# EasyEDA Pro project eSole.epro

# Schematic Schematic2
Board Name: Board2; Create Date: 2026-06-28; Page Name: P1; Project Name: foot; Schematic Name: Schematic2; Update Date: 2026-06-28; Company: EasyEDA.com; Page Size: A4; Version: V1.0
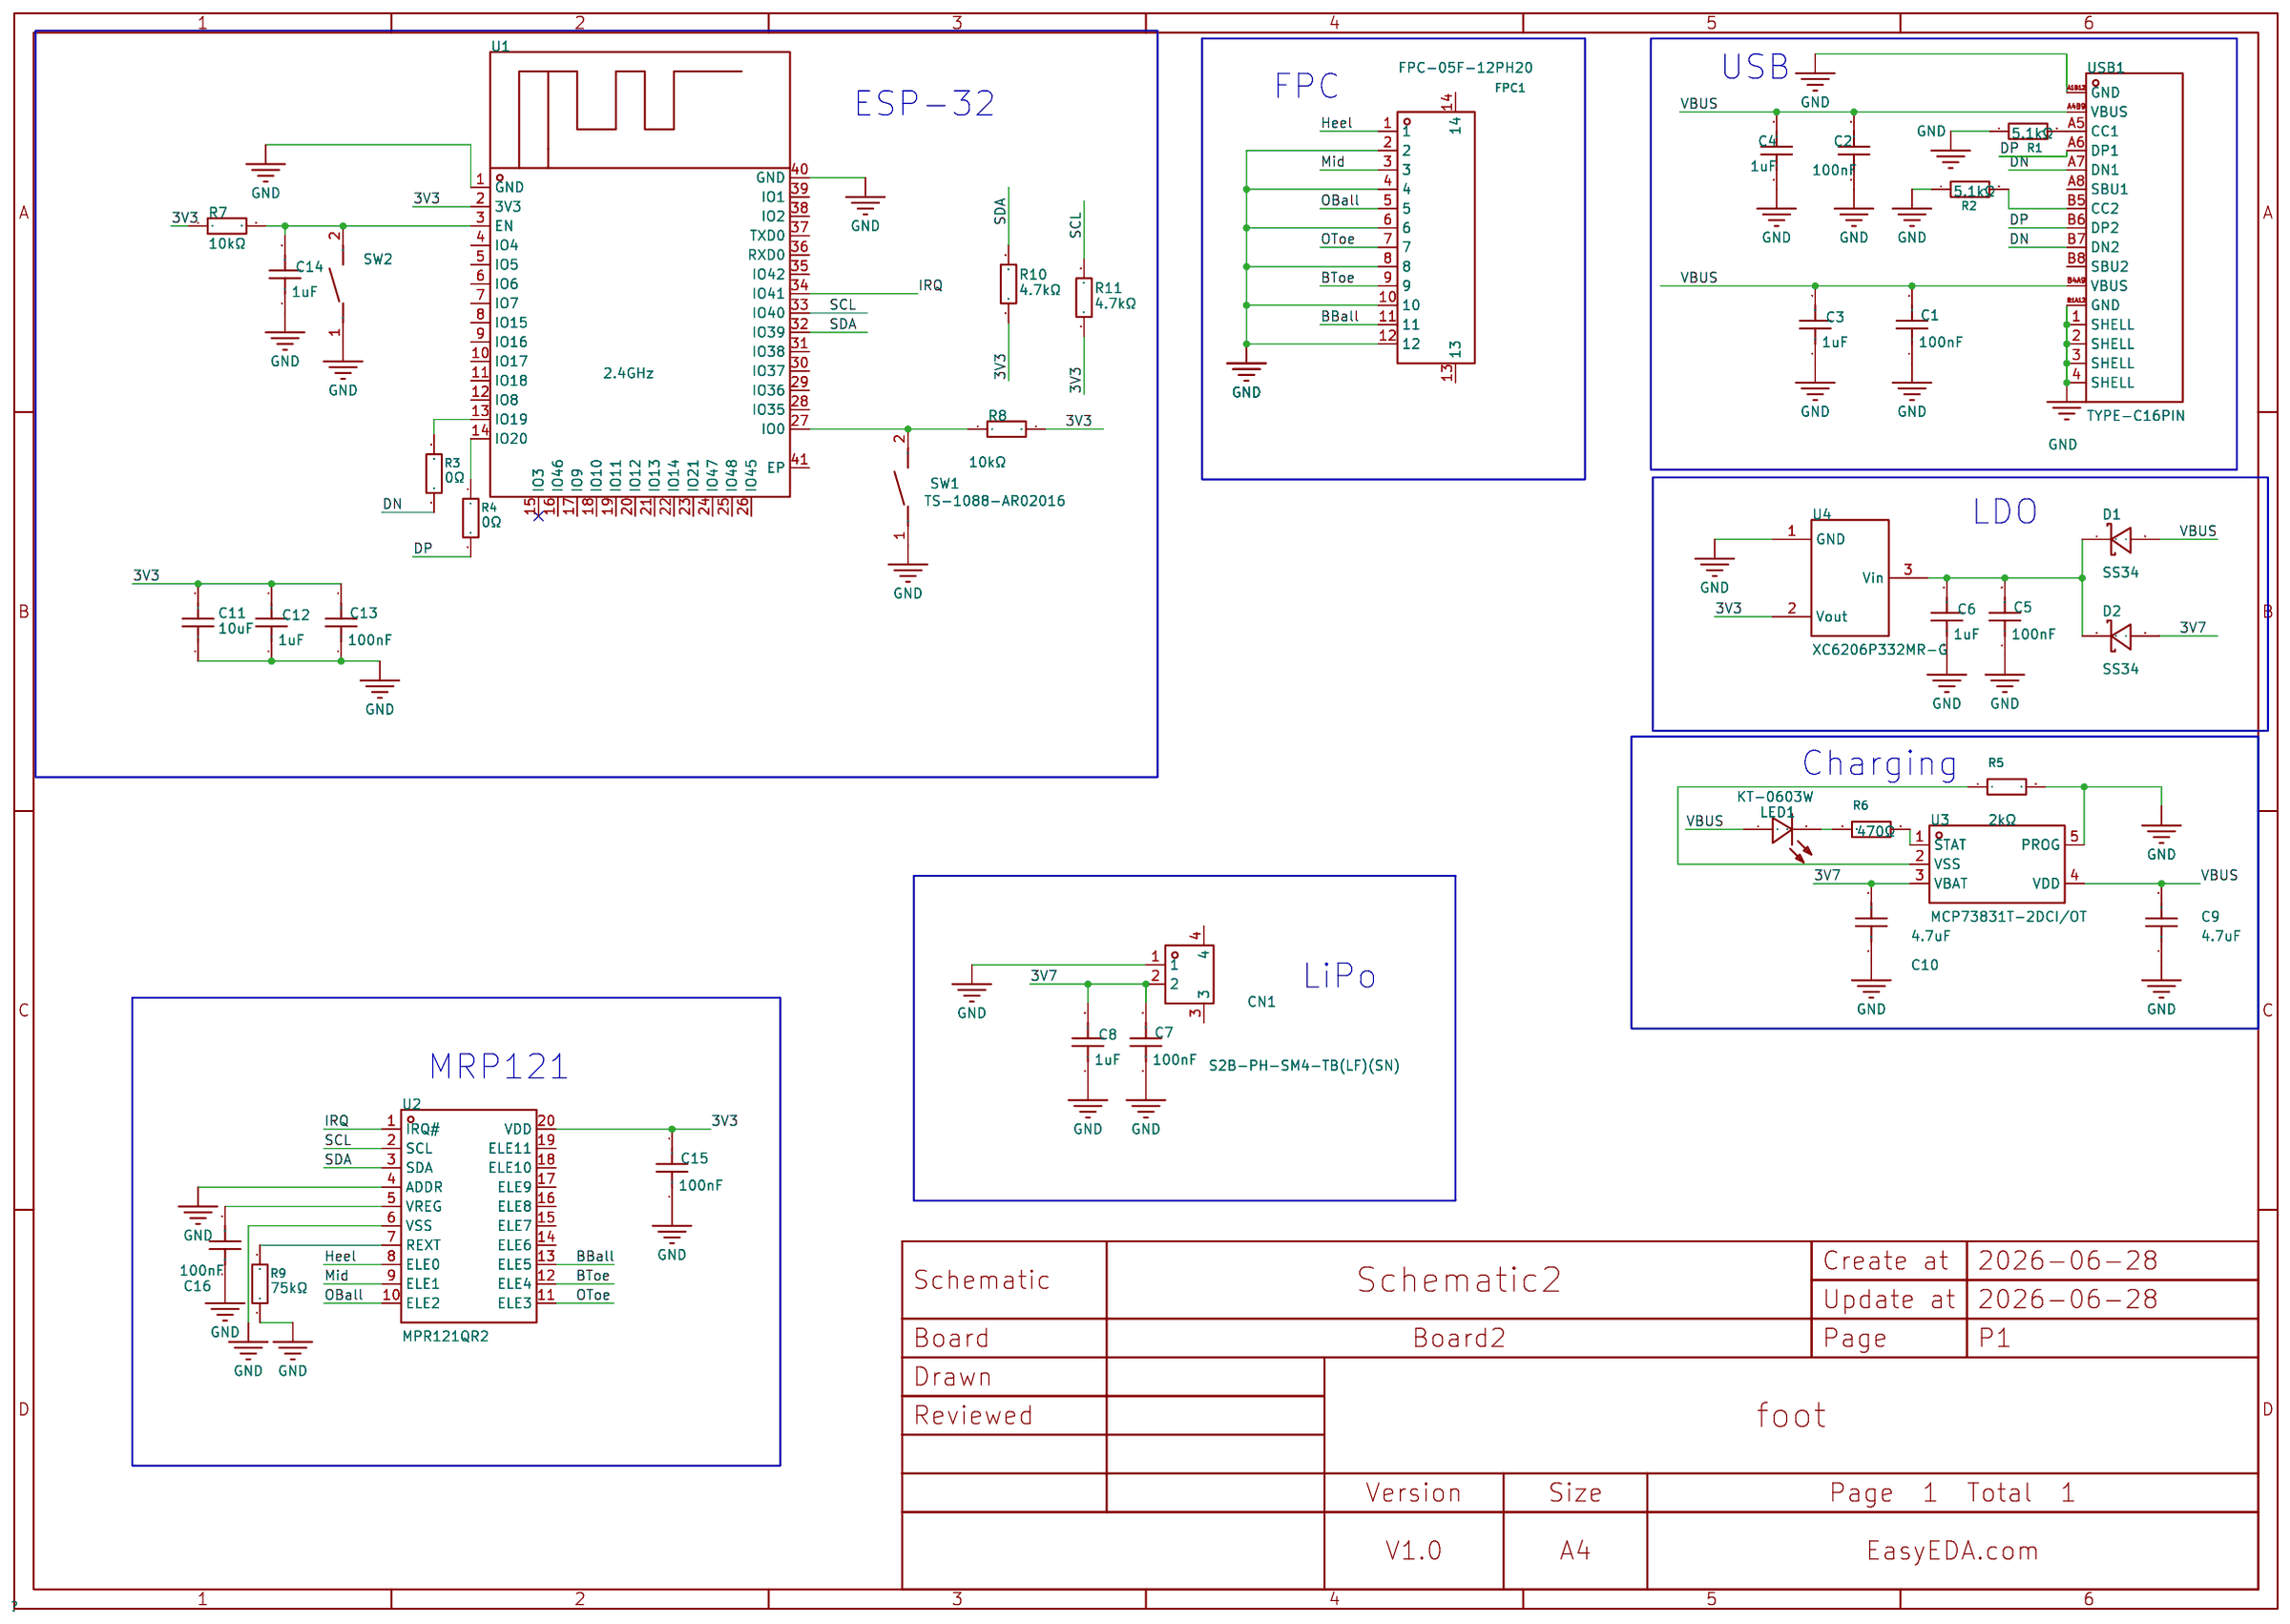
[diagram p0: schematic sheet]

## Parts
C1  100nF  [C0402]
C2  100nF  [C0402]
C3  1uF  [C0402]
C4  1uF  [C0402]
C5  100nF  [C0402]
C6  1uF  [C0402]
C7  100nF  [C0402]
C8  1uF  [C0402]
C9  4.7uF  [C0402]
C10  4.7uF  [C0402]
C11  10uF  [C0603]
C12  1uF  [C0402]
C13  100nF  [C0402]
C14  1uF  [C0402]
C15  100nF  [C0402]
C16  100nF  [C0402]
CN1  S2B-PH-SM4-TB(LF)(SN)  [CONN-SMD_P2.00_S2B-PH-SM4-TB-LF-SN]
D1  SS34  [SMA_L4.3-W2.6-LS5.2-RD]
D2  SS34  [SMA_L4.3-W2.6-LS5.2-RD]
FPC1  FPC-05F-12PH20  [FPC-SMD_12P-P0.50_FPC-05F-12PH20]
LED1  KT-0603W  [LED0603-R-RD_WHITE]
R1  5.1kΩ  [R0402]
R2  5.1kΩ  [R0402]
R3  0Ω  [R0402]
R4  0Ω  [R0402]
R5  2kΩ  [R0402]
R6  470Ω  [R0402]
R7  10kΩ  [R0402]
R8  10kΩ  [R0402]
R9  75kΩ  [R0603]
R10  4.7kΩ  [R0805]
R11  4.7kΩ  [R0805]
SW1  TS-1088-AR02016  [SW-SMD_L3.9-W3.0-P4.45]
SW2  TS-1088-AR02016  [SW-SMD_L3.9-W3.0-P4.45]
U1  2.4GHz  [WIFIM-SMD_ESP32-S3-WROOM-1-N8]
U2  MPR121QR2  [QFN-20_L3.0-W3.0-P0.40-BL]
U3  MCP73831T-2DCI/OT  [SOT-23-5_L2.9-W1.6-P0.95-LS2.8-BL]
U4  XC6206P332MR-G  [SOT-23-3_L2.9-W1.6-P1.90-LS2.8-BR]
USB1  TYPE-C16PIN  [USB-C-SMD_TYPE-C16PIN]

## Library data of the parts
C1 C2 C5 C7 C13 C15 C16 = CL05B104KO5NNNC: Capacitance:100nF Tolerance:±10% Tolerance:±10% Voltage Rating:16V Temperature Coefficient:X7R; LCSC Part Name: 100nF ±10% 16V; Supplier Part: C1525; Manufacturer: SAMSUNG(三星); Supplier Footprint: 0402; JLCPCB Part Class: Basic Part; Datasheet: https://item.szlcsc.com/datasheet/CL05B104KO5NNNC/1877.html; Supplier: LCSC; Tolerance: ±10%; Voltage Rating: 16V; Temperature Coefficient: X7R
C3 C4 C6 C8 C12 C14 = CL05A105KA5NQNC: Capacitance:1uF Tolerance:±10% Tolerance:±10% Voltage Rating:25V Temperature Coefficient:X5R; LCSC Part Name: 1uF ±10% 25V; Supplier Part: C52923; Manufacturer: SAMSUNG(三星); Supplier Footprint: 0402; JLCPCB Part Class: Basic Part; Datasheet: https://item.szlcsc.com/datasheet/CL05A105KA5NQNC/53938.html; Supplier: LCSC; Tolerance: ±10%; Voltage Rating: 25V; Temperature Coefficient: X5R
C9 C10 = CL05A475MP5NRNC: Capacitance:4.7uF Tolerance:±20% Tolerance:±20% Voltage Rating:10V Temperature Coefficient:X5R; LCSC Part Name: 4.7uF ±20% 10V; Supplier Part: C23733; Manufacturer: SAMSUNG(三星); Supplier Footprint: 0402; JLCPCB Part Class: Basic Part; Datasheet: https://item.szlcsc.com/datasheet/CL05A475MP5NRNC/24469.html; Supplier: LCSC; Tolerance: ±20%; Voltage Rating: 10V; Temperature Coefficient: X5R
C11 = CL10A106KP8NNNC: Capacitance:10uF Tolerance:±10% Tolerance:±10% Voltage Rating:10V Temperature Coefficient:X5R; LCSC Part Name: 10uF ±10% 10V; Supplier Part: C19702; Manufacturer: SAMSUNG(三星); Supplier Footprint: 0603; JLCPCB Part Class: Basic Part; Datasheet: https://item.szlcsc.com/datasheet/CL10A106KP8NNNC/20411.html; Supplier: LCSC; Tolerance: ±10%; Voltage Rating: 10V; Temperature Coefficient: X5R
CN1 = S2B-PH-SM4-TB(LF)(SN): Pins Structure:1x2P Pitch:2mm Mounting Style:Horizontal attachment Reference Series:PH Number of Pins:2P Number of Rows:1 Number of PINs Per Row:2 Row Spacing:- Current Rating (Max):2A Contact Material:Copper alloy Contact Plating:Tin Operating Temperatur; LCSC Part Name: 1x2P 间距:2mm 卧贴 系列:PH; Supplier Part: C295747; Manufacturer: JST; Supplier Footprint: SMD,P=2mm,卧贴; JLCPCB Part Class: Extended Part; Datasheet: https://atta.szlcsc.com/upload/public/pdf/source/20210203/C295747_344B2E64535E381E727D98C302AB61C7.pdf; Supplier: LCSC; Pins Structure: 1x2P; Pitch: 2mm; Mounting Style: Horizontal attachment; Reference Series: PH; Number of Pins: 2P; Number of Rows: 1; Number of PINs Per Row: 2; Current Rating (Max): 2A; Contact Material: Copper alloy; Contact Plating: Tin; Operating Temperature Range: -25℃~+85℃; Rated Voltage (Max): 100V; Plastic Material: PA; Flame Retardant Rating: UL94V-0; Supplementary Features: Auxiliary soldering legs; Colour: Beige; Z-Height of the Board: 5.5mm; X-Length of Bottom Edge on Board (Spacing Line): 7.9mm; Y-Width of Bottom Edge on Board: 8.6mm
D1 D2 = SS34_C8678: Diode Configuration:Independent Voltage - Forward(Vf@If):550mV@3A Voltage - DC Reverse(Vr):40V Current - Rectified:3A Reverse Leakage Current (Ir):500uA@40V Operating Junction Temperature Range:-55℃~+125℃ Operating Junction Temperature Range:-55℃~+125℃; LCSC Part Name: 电压:40V 电流:3A; Supplier Part: C8678; Manufacturer: MDD(辰达半导体); Supplier Footprint: SMA(DO-214AC); JLCPCB Part Class: Basic Part; Datasheet: https://item.szlcsc.com/datasheet/SS34/9178.html; Supplier: LCSC; Diode Configuration: Independent; Voltage - Forward(Vf@If): 550mV@3A; Voltage - DC Reverse(Vr): 40V; Current - Rectified: 3A; Reverse Leakage Current (Ir): 500uA@40V; Operating Junction Temperature Range: -55℃~+125℃
FPC1 = FPC-05F-12PH20: Locking Feature:Hinged Lid Contact Type:Surface Mount Number of Contacts:12P Pitch:0.5mm Mounting Type:Bottom Contact FFC, FCB Thickness:0.3mm FFC, FCB Thickness:0.3mm Height Above Board:2mm Contact Material:Phosphor Bronze Contact Plating:Tin Operating T; LCSC Part Name: 翻盖式 卧贴 P数:12P 间距:0.5mm; Supplier Part: C2856799; Manufacturer: XUNPU(讯普); Supplier Footprint: SMD,P=0.5mm,卧贴; JLCPCB Part Class: Extended Part; Datasheet: https://item.szlcsc.com/datasheet/FPC-05F-12PH20/3056897.html; Supplier: LCSC; Locking Feature: Hinged Lid; Contact Type: Surface Mount; Number of Contacts: 12P; Pitch: 0.5mm; Mounting Type: Bottom Contact; FFC, FCB Thickness: 0.3mm; Height Above Board: 2mm; Contact Material: Phosphor Bronze; Contact Plating: Tin; Operating Temperature: -25℃~+85℃; Rated Voltage (Max): 50V; Current Rating (Max): 500mA
LED1 = KT-0603W: Lamp Holder Type:1.6mm x 0.8mm square LED Illumination Color:White Voltage - Forward(Vf):2.6V~3.1V Voltage - Forward(Vf):2.6V~3.1V Power(Watts):100mW Forward Current:5mA Wavelength - Dominant:- Wavelength - Dominant:- Peak Wavelength:- Peak Wavelength:- D; LCSC Part Name: 0603 白灯 高亮; Supplier Part: C2290; Manufacturer: KENTO; Supplier Footprint: 0603; JLCPCB Part Class: Basic Part; Datasheet: https://item.szlcsc.com/datasheet/KT-0603W/2663.html; Supplier: LCSC; Lamp Holder Type: 1.6mm x 0.8mm square LED; Illumination Color: White; Voltage - Forward(Vf): 2.6V~3.1V; Power(Watts): 100mW; Forward Current: 5mA; Diode Configuration: Discrete Diode; Lens Color: Yellow Lens; Color Temperature: 40000K~100000K; Luminous Intensity: 360mcd; Viewing Angle: 120°; Mounting Style: Top-mount; Operating Temperature: -40℃~+85℃
R1 R2 = 0402WGF5101TCE: Type:Thick Film Resistor Resistance:5.1kΩ Tolerance:±1% Tolerance:±1% Power(Watts):62.5mW Voltage-Supply(Max):50V Temperature Coefficient:±100ppm/℃ Temperature Coefficient:±100ppm/℃ Operating Temperature:-55℃~+155℃ Operating Temperature:-55℃~+155℃; LCSC Part Name: 5.1kΩ ±1% 62.5mW 厚膜电阻; Supplier Part: C25905; Manufacturer: UNI-ROYAL(厚声); Supplier Footprint: 0402; JLCPCB Part Class: Basic Part; Datasheet: https://item.szlcsc.com/datasheet/0402WGF5101TCE/26648.html; Supplier: LCSC; Type: Thick Film Resistor; Tolerance: ±1%; Power(Watts): 62.5mW; Voltage-Supply(Max): 50V; Temperature Coefficient: ±100ppm/℃; Operating Temperature: -55℃~+155℃
R3 R4 = 0402WGF0000TCE: Type:Thick Film Resistor Resistance:0Ω Tolerance:±1% Tolerance:±1% Power(Watts):62.5mW Voltage-Supply(Max):50V Temperature Coefficient:±800ppm/℃ Temperature Coefficient:±800ppm/℃ Operating Temperature:-55℃~+155℃ Operating Temperature:-55℃~+155℃; LCSC Part Name: 0Ω ±1% 62.5mW 厚膜电阻; Supplier Part: C17168; Manufacturer: UNI-ROYAL(厚声); Supplier Footprint: 0402; JLCPCB Part Class: Basic Part; Datasheet: https://item.szlcsc.com/datasheet/0402WGF0000TCE/17853.html; Supplier: LCSC; Type: Thick Film Resistor; Tolerance: ±1%; Power(Watts): 62.5mW; Voltage-Supply(Max): 50V; Temperature Coefficient: ±800ppm/℃; Operating Temperature: -55℃~+155℃
R5 = 0402WGF2001TCE: Type:Thick Film Resistors Resistance:2kΩ Tolerance:±1% Tolerance:±1% Power(Watts): Overload Voltage (Max): Temperature Coefficient:±100ppm/℃ Temperature Coefficient:±100ppm/℃ Operating Temperature Range:-55℃~+155℃ Operating Temperature Range:-55℃~+155℃; LCSC Part Name: 2kΩ ±1% 62.5mW 厚膜电阻; Supplier Part: C4109; Manufacturer: UNI-ROYAL(厚声); Supplier Footprint: 0402; JLCPCB Part Class: Basic Part; Datasheet: https://atta.szlcsc.com/upload/public/pdf/source/20200306/C422600_1E6D84923E4A46A82E41ADD87F860B5C.pdf; Supplier: LCSC; Type: Thick Film Resistors; Tolerance: ±1%; Temperature Coefficient: ±100ppm/℃; Operating Temperature Range: -55℃~+155℃
R6 = 0402WGF4700TCE: Type:Thick Film Resistor Resistance:470Ω Tolerance:±1% Tolerance:±1% Power(Watts):62.5mW Voltage-Supply(Max):50V Temperature Coefficient:±100ppm/℃ Temperature Coefficient:±100ppm/℃ Operating Temperature:-55℃~+155℃ Operating Temperature:-55℃~+155℃; LCSC Part Name: 470Ω ±1% 62.5mW 厚膜电阻; Supplier Part: C25117; Manufacturer: UNI-ROYAL(厚声); Supplier Footprint: 0402; JLCPCB Part Class: Basic Part; Datasheet: https://item.szlcsc.com/datasheet/0402WGF4700TCE/25860.html; Supplier: LCSC; Type: Thick Film Resistor; Tolerance: ±1%; Power(Watts): 62.5mW; Voltage-Supply(Max): 50V; Temperature Coefficient: ±100ppm/℃; Operating Temperature: -55℃~+155℃
R7 R8 = 0402WGF1002TCE: Type:Thick Film Resistor Resistance:10kΩ Tolerance:±1% Tolerance:±1% Power(Watts):62.5mW Voltage-Supply(Max):50V Temperature Coefficient:±100ppm/℃ Temperature Coefficient:±100ppm/℃ Operating Temperature:-55℃~+155℃ Operating Temperature:-55℃~+155℃; LCSC Part Name: 10kΩ ±1% 62.5mW 厚膜电阻; Supplier Part: C25744; Manufacturer: UNI-ROYAL(厚声); Supplier Footprint: 0402; JLCPCB Part Class: Basic Part; Datasheet: https://item.szlcsc.com/datasheet/0402WGF1002TCE/26487.html; Supplier: LCSC; Type: Thick Film Resistor; Tolerance: ±1%; Power(Watts): 62.5mW; Voltage-Supply(Max): 50V; Temperature Coefficient: ±100ppm/℃; Operating Temperature: -55℃~+155℃
R9 = 0603WAF7502T5E: Type:Thick Film Resistor Resistance:75kΩ Tolerance:±1% Tolerance:±1% Power(Watts):100mW Voltage-Supply(Max):75V Temperature Coefficient:±100ppm/℃ Temperature Coefficient:±100ppm/℃ Operating Temperature:-55℃~+155℃ Operating Temperature:-55℃~+155℃; LCSC Part Name: 75kΩ ±1% 100mW 厚膜电阻; Supplier Part: C23242; Manufacturer: UNI-ROYAL(厚声); Supplier Footprint: 0603; JLCPCB Part Class: Basic Part; Datasheet: https://item.szlcsc.com/datasheet/0603WAF7502T5E/23969.html; Supplier: LCSC; Type: Thick Film Resistor; Tolerance: ±1%; Power(Watts): 100mW; Voltage-Supply(Max): 75V; Temperature Coefficient: ±100ppm/℃; Operating Temperature: -55℃~+155℃
R10 R11 = 0805W8F4701T5E: Type:Thick Film Resistors Resistance:4.7kΩ Tolerance:±1% Tolerance:±1% Power(Watts): Overload Voltage (Max): Temperature Coefficient:±100ppm/℃ Temperature Coefficient:±100ppm/℃ Operating Temperature Range:-55℃~+155℃ Operating Temperature Range:-55℃~+155℃; LCSC Part Name: 4.7kΩ ±1% 125mW 厚膜电阻; Supplier Part: C17673; Manufacturer: UNI-ROYAL(厚声); Supplier Footprint: 0805; JLCPCB Part Class: Basic Part; Datasheet: https://atta.szlcsc.com/upload/public/pdf/source/20200306/C422600_1E6D84923E4A46A82E41ADD87F860B5C.pdf; Supplier: LCSC; Type: Thick Film Resistors; Tolerance: ±1%; Temperature Coefficient: ±100ppm/℃; Operating Temperature Range: -55℃~+155℃
SW1 SW2 = TS-1088-AR02016: Circuit:SPST Actuator Style:Round Button Operating Force:1.6N Mounting Type:Surface Mount,Vertical Length:3.9mm Width:3mm Switch Height:2mm with Bracket:Without Bracket Contact Current:50mA Voltage Rating:12V Actuator/Cap Color:Black With Lamp:- IP Rating; LCSC Part Name: 3.9*3*2mm 立贴 轻触开关; Supplier Part: C720477; Manufacturer: XUNPU(讯普); Supplier Footprint: SMD,4x3mm; JLCPCB Part Class: Basic Part; Datasheet: https://item.szlcsc.com/datasheet/TS-1088-AR02016/763484.html; Supplier: LCSC; Circuit: SPST; Actuator Style: Round Button; Operating Force: 1.6N; Mounting Type: Surface Mount,Vertical; Length: 3.9mm; Width: 3mm; Switch Height: 2mm; with Bracket: Without Bracket; Contact Current: 50mA; Voltage Rating: 12V; Actuator/Cap Color: Black; Termination Style: SMD(SMT) Tab; Life: 100,000 cycles; Operating Temperature: -30℃~+80℃
U1 = ESP32-S3-WROOM-1-N8: Utilized IC / Part:ESP32-S3 Chip Wireless Standard:Bluetooth5.0 Interface Type:SPI；I2S；USB；I2C；UART Frequency:2.4GHz Antenna Type:On-board PCB Antenna Output Power:20.5dBm Output Power:20.5dBm Voltage - Supply:3V~3.6V Voltage - Supply:3V~3.6V Receive  Cur; LCSC Part Name: 不带固件 通用型Wi-Fi+低功耗蓝牙MCU模组; Supplier Part: C2913198; Manufacturer: ESPRESSIF(乐鑫); Supplier Footprint: SMD,25.5x18mm; JLCPCB Part Class: Extended Part; Datasheet: https://item.szlcsc.com/datasheet/ESP32-S3-WROOM-1-N8/3198296.html; Supplier: LCSC; Utilized IC / Part: ESP32-S3 Chip; Wireless Standard: Bluetooth5.0; Interface Type: SPI；I2S；USB；I2C；UART; Antenna Type: On-board PCB Antenna; Output Power: 20.5dBm; Voltage - Supply: 3V~3.6V; Receive  Current: 95mA; Send  Current: 355mA; Sensitivity: -98.2dBm; Operating Temperature: -40℃~+85℃
U2 = MPR121QR2: Number of Channels:12 Chip Function:Capacitive Touch Voltage - Supply:1.71V~3.6V Voltage - Supply:1.71V~3.6V Current - Supply:29uA Operating Temperature:-40℃~+85℃ Operating Temperature:-40℃~+85℃ Standby Current:3uA ESD Protection Voltage:2kV; Supplier Part: C91322; Manufacturer: NXP(恩智浦); Supplier Footprint: QFN-20(3x3); JLCPCB Part Class: Extended Part; Datasheet: https://item.szlcsc.com/datasheet/MPR121QR2/92511.html; Supplier: LCSC; Number of Channels: 12; Chip Function: Capacitive Touch; Voltage - Supply: 1.71V~3.6V; Current - Supply: 29uA; Operating Temperature: -40℃~+85℃; Standby Current: 3uA; ESD Protection Voltage: 2kV
U3 = MCP73831T-2DCI/OT: The Chip Type:Charging IC Voltage - Supply:3.75V~6V Voltage - Supply:3.75V~6V Charge Current - Max:550mA Charging Saturation Voltage:4.2V End-Off Voltage:- Type of Battery:Lithium Battery Number of Cells:1 Number of Cells:1 Operating Temperature:-40℃~+85℃; LCSC Part Name: 单节全集成锂离子/锂聚合物充电管理控制器; Supplier Part: C625597; Manufacturer: MICROCHIP(美国微芯); Supplier Footprint: SOT-23-5; JLCPCB Part Class: Extended Part; Datasheet: https://item.szlcsc.com/datasheet/MCP73831T-2DCI%252FOT/655504.html; Supplier: LCSC; The Chip Type: Charging IC; Voltage - Supply: 3.75V~6V; Charge Current - Max: 550mA; Charging Saturation Voltage: 4.2V; Type of Battery: Lithium Battery; Number of Cells: 1; Operating Temperature: -40℃~+85℃; Battery Temperature Detection: Not supported; Supply Current (Iq): 53uA
U4 = XC6206P332MR-G_C5446: Output Configuration:Positive Voltage - Supply:6V Output Voltage:3.3V Output Voltage:3.3V Output Current:200mA Power Supply Rejection Ratio (PSRR):- Voltage Dropout:- standby current:1uA Noise:- Features:Short Circuit Protection；Over Current Protection Op; LCSC Part Name: 3.3V 200mA 6V; Supplier Part: C5446; Manufacturer: TOREX(特瑞仕); Supplier Footprint: SOT-23-3L; JLCPCB Part Class: Basic Part; Datasheet: https://item.szlcsc.com/datasheet/XC6206P332MR-G/5896.html; Supplier: LCSC; Output Configuration: Positive; Voltage - Supply: 6V; Output Voltage: 3.3V; Output Current: 200mA; standby current: 1uA; Features: Short Circuit Protection；Over Current Protection; Operating Temperature: -40℃~+85℃@(Ta); Output Type: Fixed; Number of Outputs: 1
USB1 = TYPE-C16PIN: Connector Type:Type-C Protocol Standard:- Gender:Female Mounting Type:Surface Mount, Right Angle Number of Contacts:16P Number of Ports:1 Current Rating-Power:3A Voltage Rating:30V Connect-Disconnect Life:10,000 Cycles Supplementary Features:- Center Heig; LCSC Part Name: 16P卧贴母座; Supplier Part: C393939; Manufacturer: SHOU HAN(首韩); Supplier Footprint: SMD; JLCPCB Part Class: Extended Part; Datasheet: https://item.szlcsc.com/datasheet/TYPE-C16PIN/372551.html; Supplier: LCSC; Connector Type: Type-C; Gender: Female; Mounting Type: Surface Mount, Right Angle; Number of Contacts: 16P; Number of Ports: 1; Current Rating-Power: 3A; Voltage Rating: 30V; Connect-Disconnect Life: 10,000 Cycles; Detection color: Black; Operating Temperature: -40℃~+85℃

## Nets
3V3: C11.2 C12.2 C13.2 C15.2 R7.1 R8.2 R10.1 R11.1 U1.2(3V3) U2.20(VDD) U4.2(Vout)
3V7: C7.2 C8.2 C10.2 CN1.2 D2.2(A) U3.3(VBAT)
GND: C1.1 C2.1 C3.1 C4.1 C5.1 C6.1 C7.1 C8.1 C9.1 C10.1 C11.1 C12.1 C13.1 C14.1 C15.1 C16.1 CN1.1 FPC1.2 FPC1.4 FPC1.6 FPC1.8 FPC1.10 FPC1.12 R1.1 R2.1 R5.2 R9.1 SW1.1 SW2.1 U1.1(GND) U1.40(GND) U2.4(ADDR) U2.6(VSS) U3.5(PROG) U4.1(GND) USB1.1(SHELL) USB1.2(SHELL) USB1.3(SHELL) USB1.4(SHELL) USB1.A1B12(GND) USB1.B1A12(GND)
VBUS: C1.2 C2.2 C3.2 C4.2 C9.2 D1.2(A) LED1.1(A) U3.4(VDD) USB1.A4B9(VBUS) USB1.B4A9(VBUS)
BBall: FPC1.11 U2.13(ELE5)
BToe: FPC1.9 U2.12(ELE4)
DN: R3.1 USB1.A7(DN1) USB1.B7(DN2)
DP: R4.2 USB1.A6(DP1) USB1.B6(DP2)
Heel: FPC1.1 U2.8(ELE0)
IRQ: U1.34(IO41) U2.1(IRQ#)
Mid: FPC1.3 U2.9(ELE1)
OBall: FPC1.5 U2.10(ELE2)
OToe: FPC1.7 U2.11(ELE3)
SCL: R11.2 U1.33(IO40) U2.2(SCL)
SDA: R10.2 U1.32(IO39) U2.3(SDA)
$1N6: R1.2 USB1.A5(CC1)
$1N8: R2.2 USB1.B5(CC2)
$1N10: C5.2 C6.2 D1.1(K) D2.1(K) U4.3(Vin)
$1N17: R3.2 U1.13(IO19)
$1N49: R5.1 U3.2(VSS)
$1N54: R6.2 U3.1(STAT)
$1N55: LED1.2(K) R6.1
$1N65: C14.2 R7.2 SW2.2 U1.3(EN)
$1N68: R8.1 SW1.2 U1.27(IO0)
$1N84: C16.2 U2.5(VREG)
$1N85: R9.2 U2.7(REXT)
$1N93: R4.1 U1.14(IO20)

Not connected (* = marked no-connect by the designer): CN1 3 4; FPC1 13 14; U1 4(IO4) 5(IO5) 6(IO6) 7(IO7) 8(IO15) 9(IO16) 10(IO17) 11(IO18) 12(IO8) 15(IO3)* 16(IO46) 17(IO9) 18(IO10) 19(IO11) 20(IO12) 21(IO13) 22(IO14) 23(IO21) 24(IO47) 25(IO48) 26(IO45) 28(IO35) 29(IO36) 30(IO37) 31(IO38) 35(IO42) 36(RXD0) 37(TXD0) 38(IO2) 39(IO1) 41(EP); U2 14(ELE6) 15(ELE7) 16(ELE8) 17(ELE9) 18(ELE10) 19(ELE11); USB1 A8(SBU1) B8(SBU2)

## Notes on the sheet
- USB
- FPC
- ESP-32
- LDO
- Charging
- LiPo
- MRP121

# Schematic Schematic1
Board Name: Board1; Create Date: 2026-06-20; Page Name: P1; Project Name: foot; Schematic Name: Schematic1; Update Date: 2026-06-20; Company: EasyEDA.com; Page Size: A4; Version: V1.0
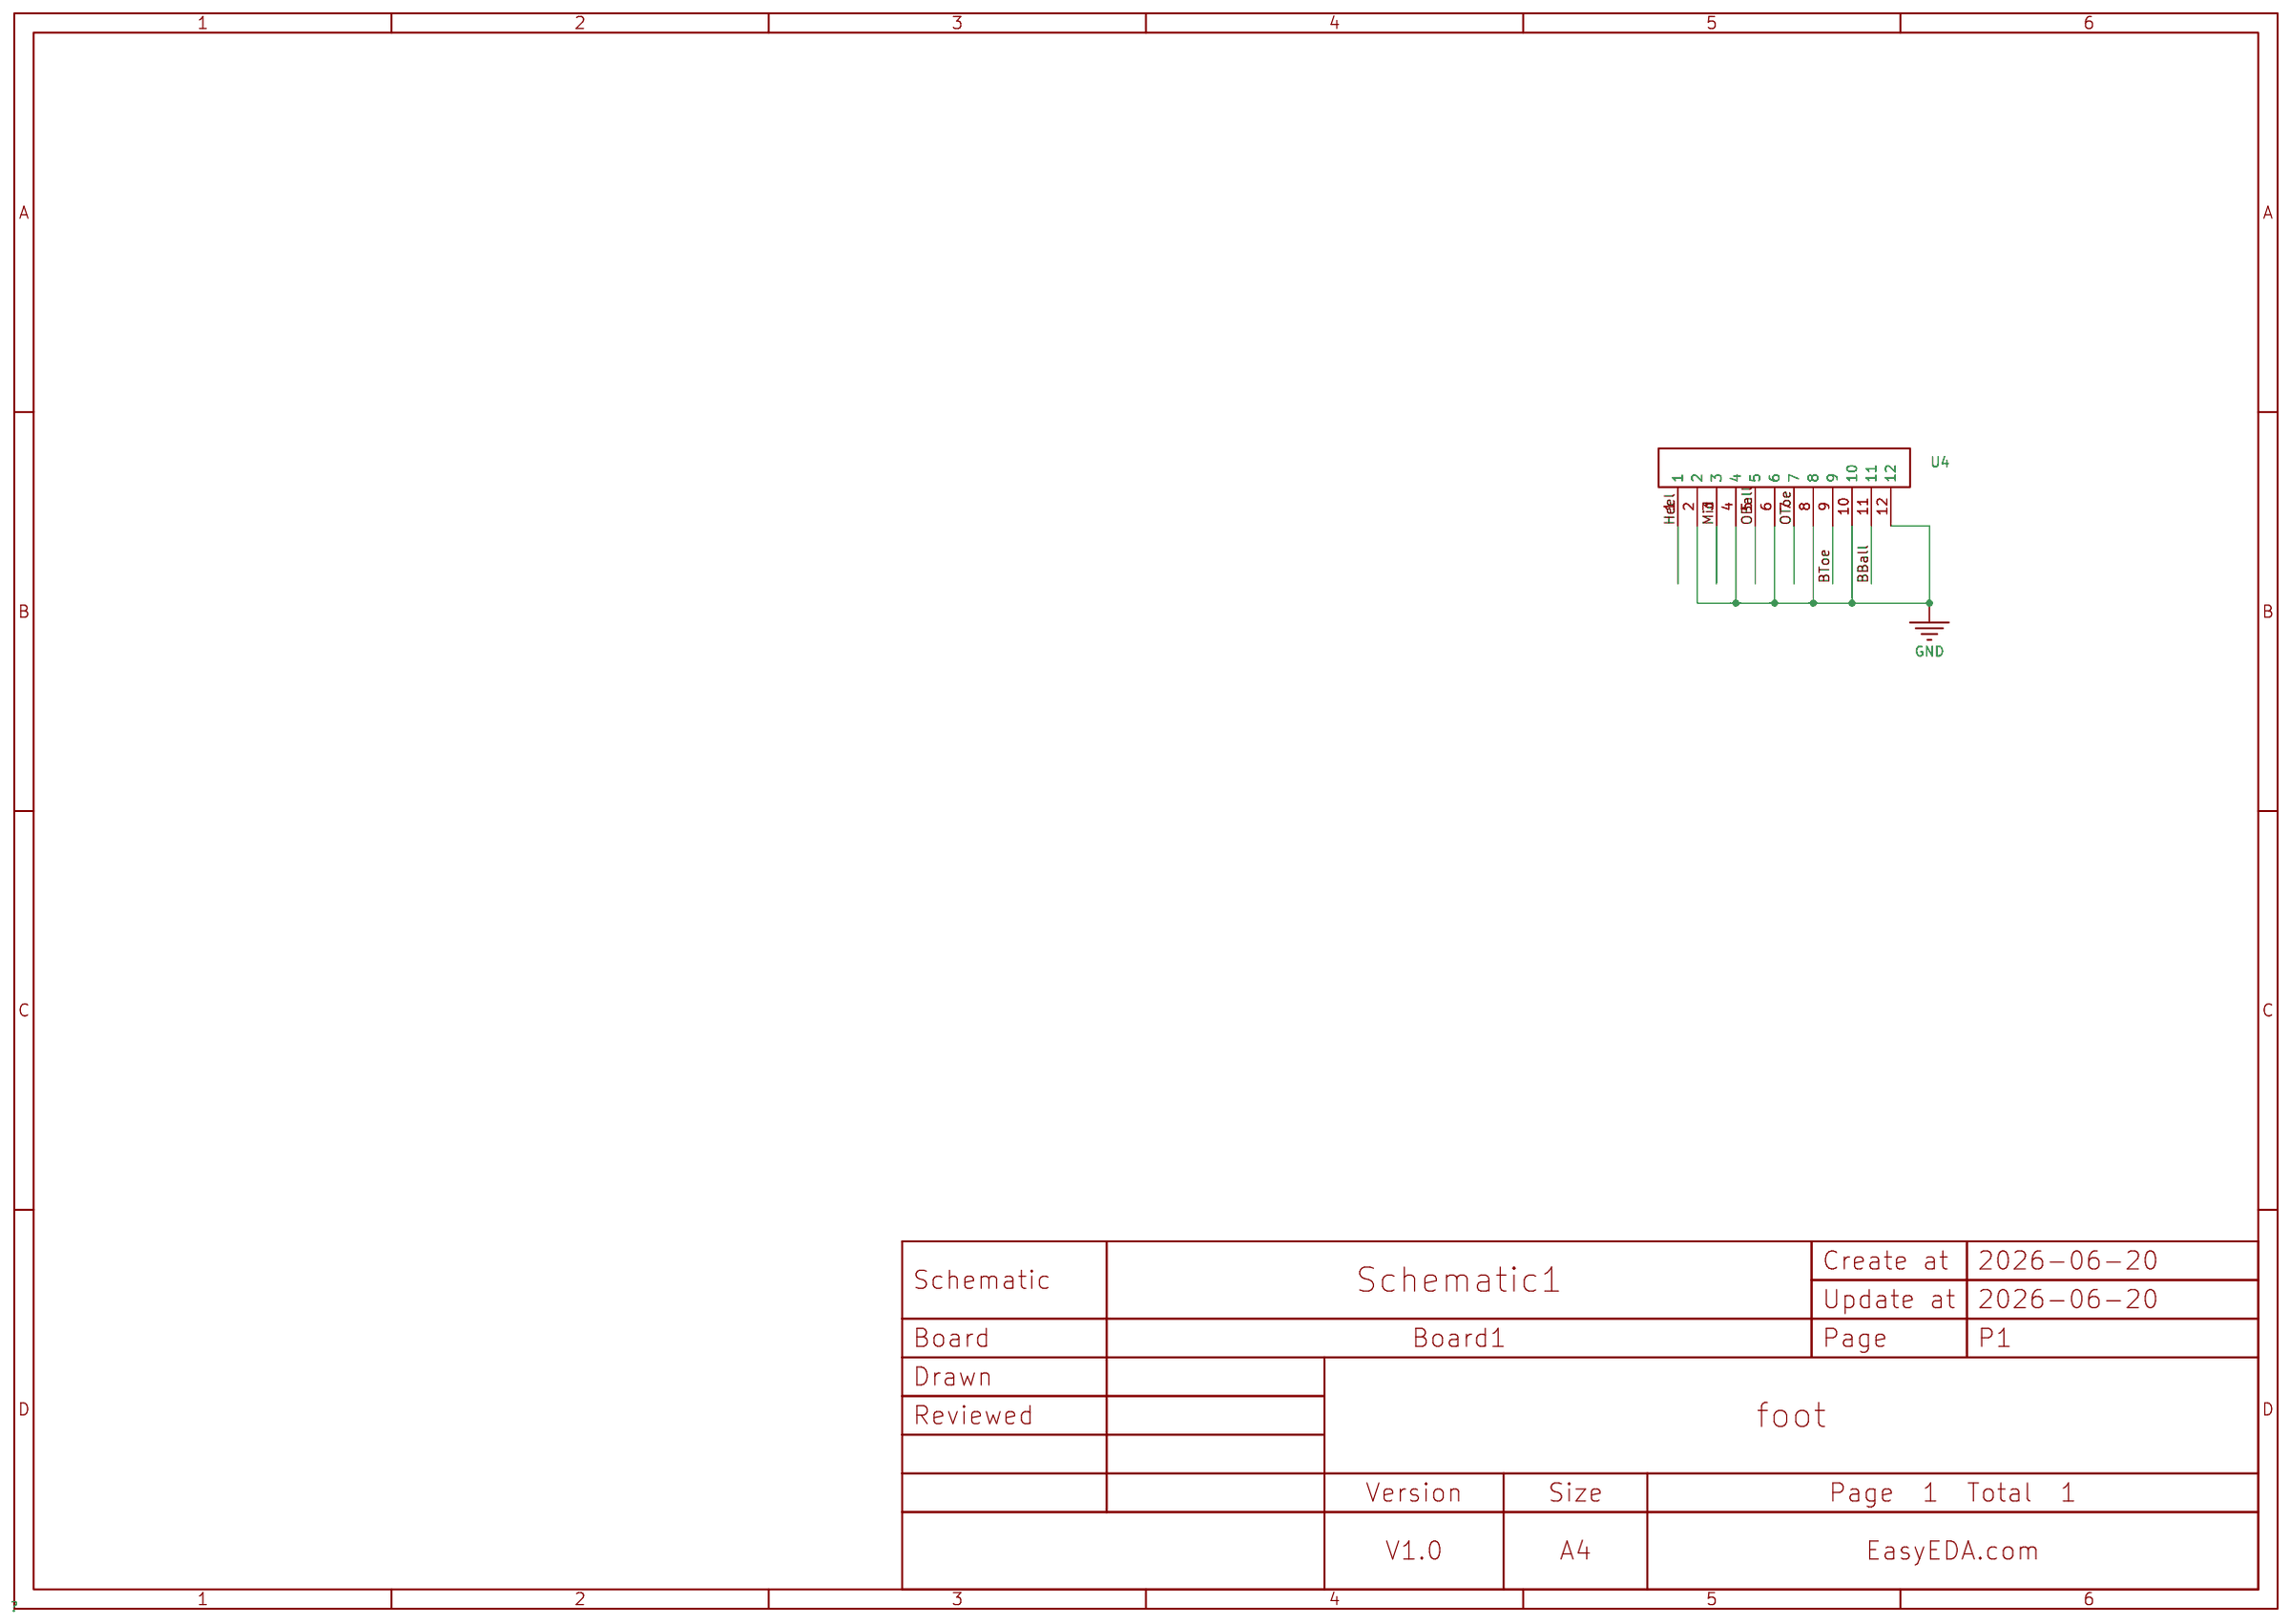
[diagram p1: schematic sheet]

## Parts
U4  -  [FlatCable-12pin]

## Library data of the parts
U4 = FPC-12PIN

## Nets
GND: U4.2 U4.4 U4.6 U4.8 U4.10 U4.12
BBall: U4.11
BToe: U4.9
Heel: U4.1
Mid: U4.3
OBall: U4.5
OToe: U4.7

# Board PCB1
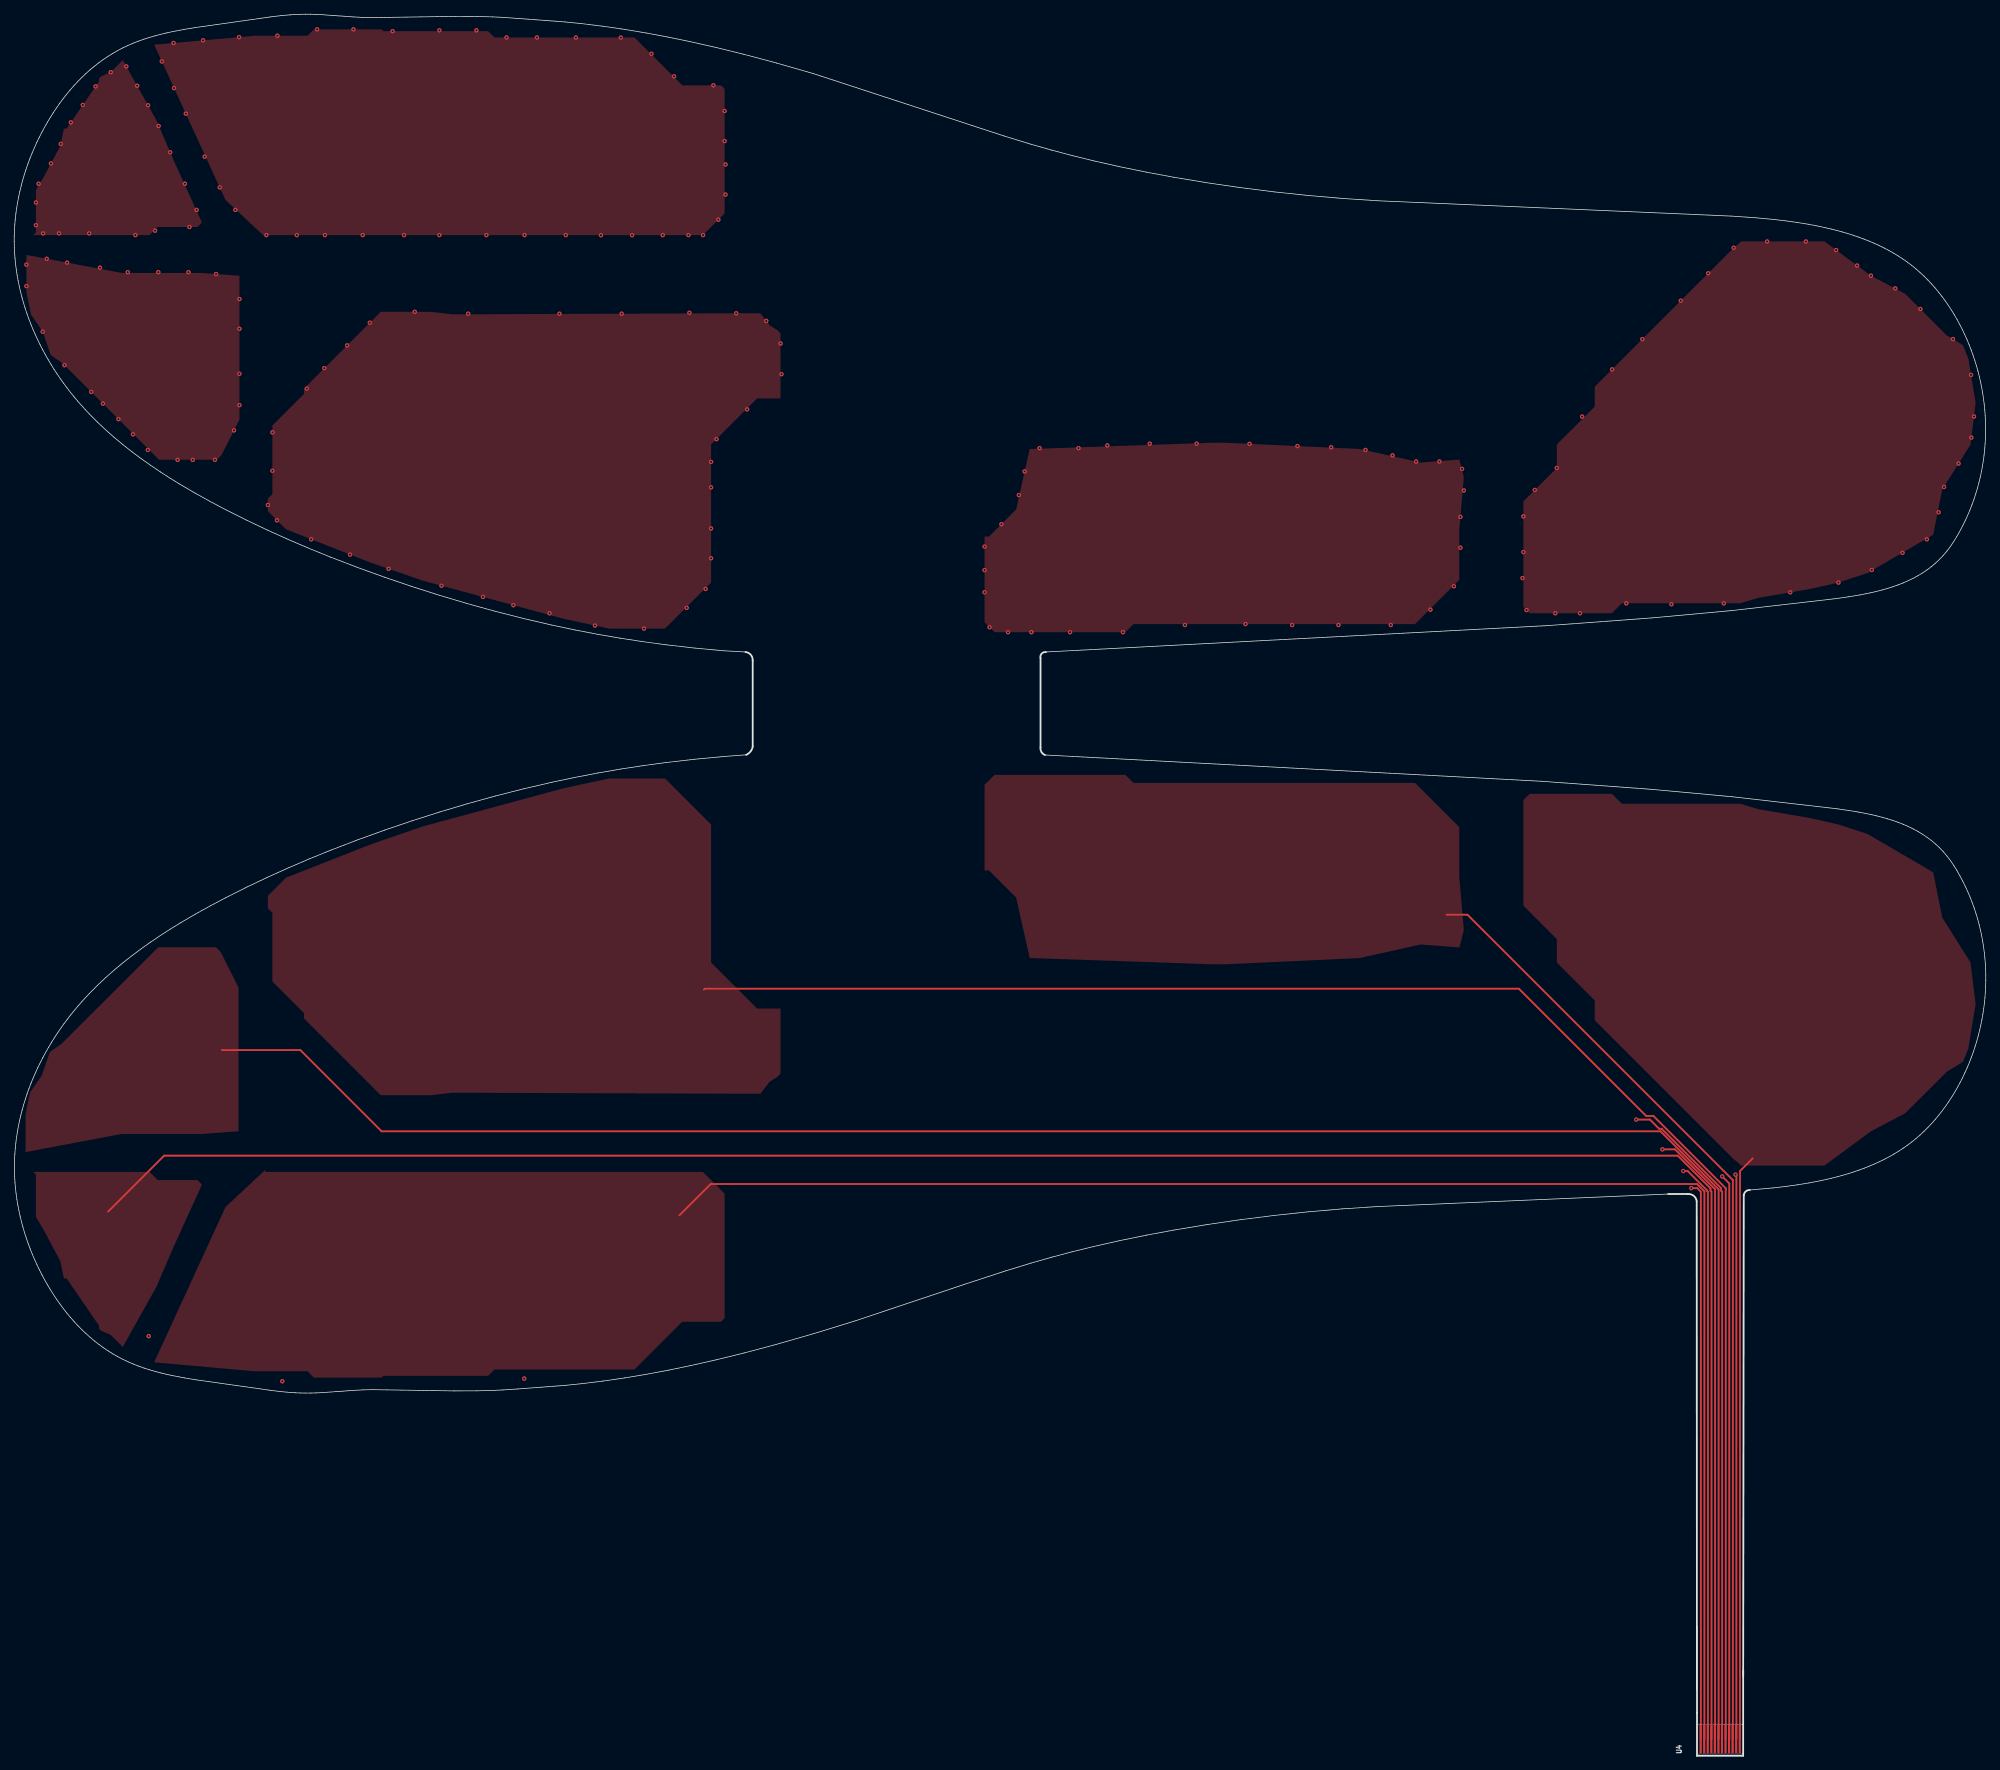
[diagram p2: board, top side]
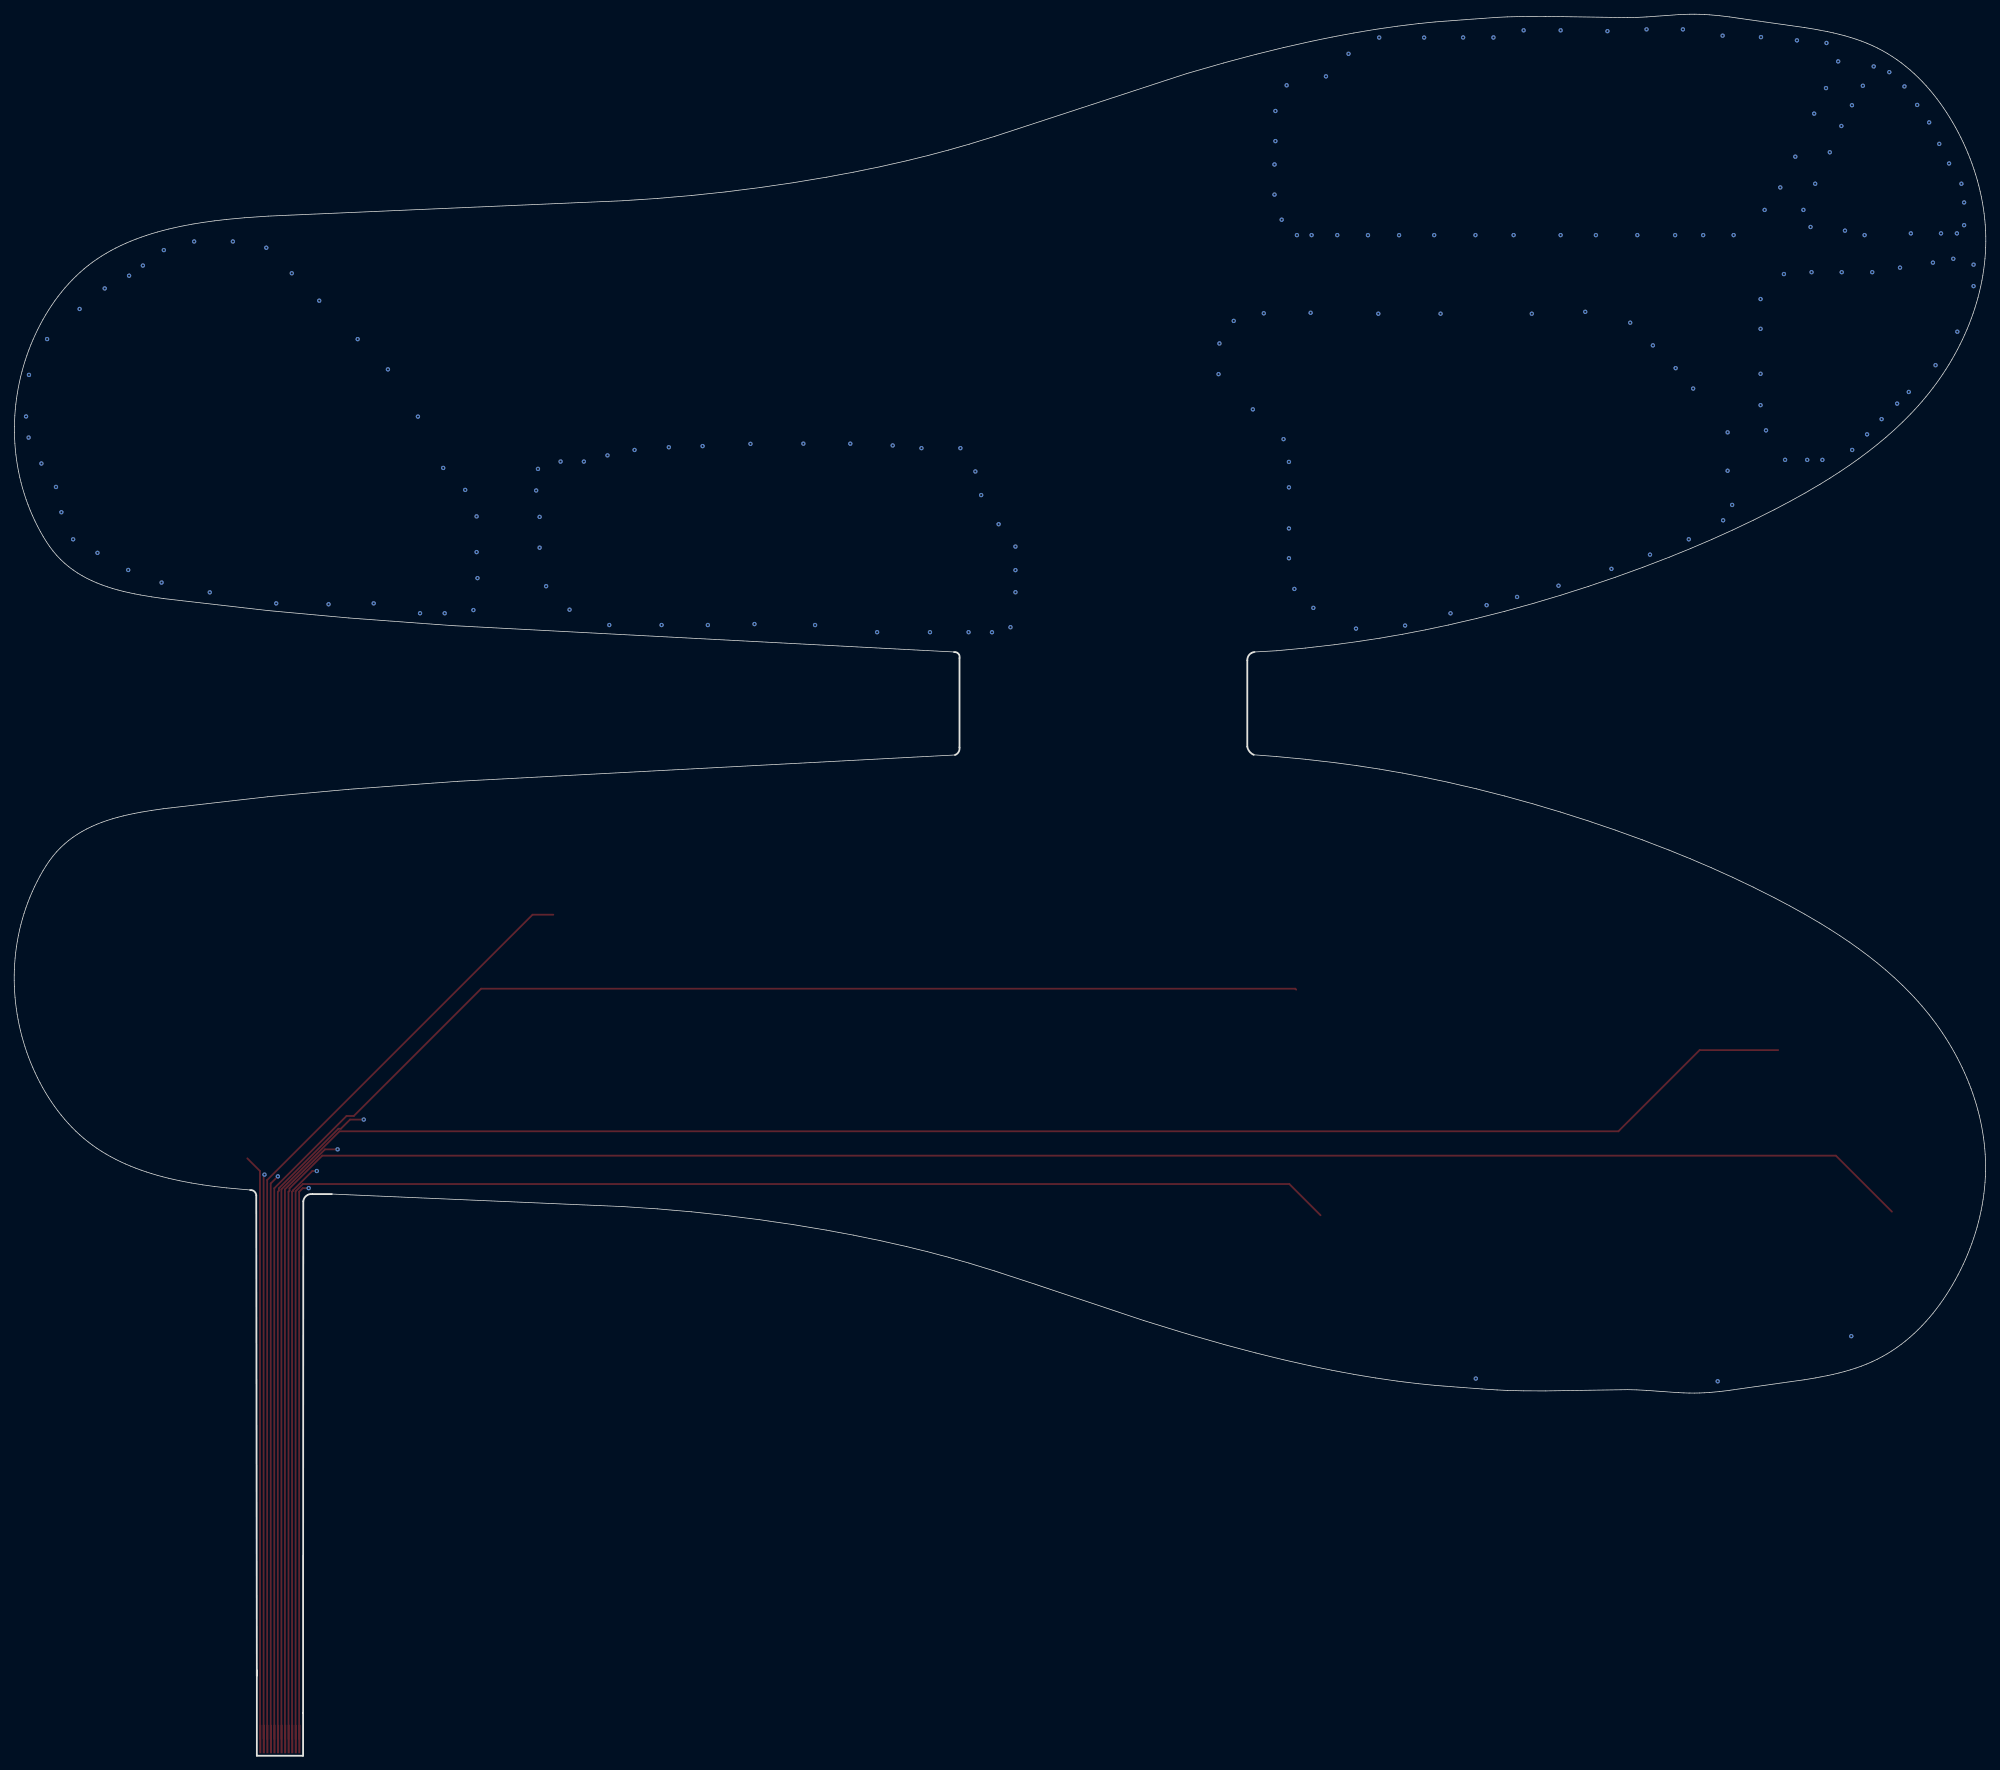
[diagram p3: board, bottom side, seen from below]

Outline 277.41 x 245.09 mm; copper layers: Top Layer, Bottom Layer. Coordinates in mm from the lower left corner of the outline.
Stack: Top Layer 0.035mm / Dielectric1 1.51mm FR4 er 4.5 / Bottom Layer 0.035mm

## Design rules (mm)
spacing copperThickness1oz (default): track to track 0.102, other pairs 0.152 to 0.3
spacing copperThickness2oz: track to track 0.203, other pairs 0.152 to 0.3
track width copperThickness1oz (default): min 0.127, default 0.254, max 2.54
track width copperThickness2oz: min 0.203, default 0.254, max 2.54
differential pair differentialPair (default): width min 0.127, default 0.254, max 2.54; gap min 0.152, default 0.152
net GND uses copperRegion

## Placement (name value [footprint] x y rotation side)
U4  -  [FlatCable-12pin]  240.03 0.25 90 top

## Footprints (pads in the part's own frame, mm; a bottom-side part is the same pattern mirrored in y, then rotated)
FlatCable-12pin
  rect 4x0.3 smd: 1(2.101,-2.75) 2(2.101,-2.25) 3(2.101,-1.75) 4(2.101,-1.25) 5(2.101,-0.75) 6(2.101,-0.25) 7(2.101,0.25) 8(2.101,0.75) 9(2.101,1.25) 10(2.101,1.75) 11(2.101,2.25) 12(2.101,2.75)

## Nets
As in the schematic.

## Via types
v1: diameter 0.61, hole 0.305, Top Layer to Bottom Layer, 200 vias

## Routing (per net, layer and track width the routed paths; a pad name or vN(x,y) marks a point on that pad's centre or on a via; arc(x,y) is an arc through that point)
GND: length 499.9
  Top Layer w0.254: v1(231.91,85.34) 233.68,85.34 239.31,79.71 239.31,2.35 ; v1(234.83,82.3) 235.46,82.3 238.17,79.58 238.17,79.52 238.31,79.38 238.31,2.35 ; v1(240.31,81.54) 241.31,80.54 241.31,2.35 ; 237.31,2.35 237.31,79.38 236.81,79.88 v1(235.97,79.88) ; 242.31,2.35 242.31,81.67 v1(242.19,81.79) ; 240.31,2.35 240.31,79.38 240.17,79.52 240.17,79.86 231.79,88.24 231.45,88.24 230.15,89.53 228.35,89.53
  vias: v1(1.72,209.85) v1(1.72,206.82) v1(3.05,218.6) v1(3.05,215.4) v1(3.43,221.23) v1(4.07,214.25) v1(4,200.41) v1(4.57,210.67) v1(5.17,224.08) v1(6.3,214.25) v1(6.55,226.84) v1(7.07,195.7) v1(7.44,210.13) v1(7.97,229.86) v1(9.66,232.32) v1(10.55,214.25) v1(10.84,191.93) v1(11.44,234.93) v1(12.07,209.42) v1(12.48,190.29) v1(13.58,236.94) v1(14.66,188.11) v1(15.77,237.75) v1(15.98,208.79) v1(16.7,185.97) v1(17.05,214) v1(17.3,235.02) v1(18.83,232.28) v1(18.8,183.77) v1(18.93,59.05) v1(19.82,214.63) v1(20.27,208.79) v1(20.32,229.36) v1(20.77,238.45) v1(21.95,225.66) v1(22.41,241.04) v1(22.48,234.7) v1(22.99,182.37) v1(24.01,221.23) v1(24.15,231.1) v1(24.52,208.79) v1(24.66,215.15) v1(25.13,182.37) v1(25.66,217.55) v1(26.57,241.42) v1(26.8,225.04) v1(28.24,182.38) v1(28.4,208.52) v1(28.92,220.71) v1(30.92,186.53) v1(31.12,217.55) v1(31.63,241.87) v1(31.69,205) v1(31.69,200.82) v1(31.69,194.49) v1(31.69,190.08) v1(35.48,214) v1(35.69,176.03) v1(36.33,186.25) v1(36.33,180.84) v1(36.96,173.87) v1(37.03,242.07) v1(37.72,52.7) v1(39.77,214) v1(41.17,192.41) v1(41.79,171.2) v1(42.62,242.96) v1(43.64,195.28) v1(43.72,214) v1(46.84,198.48) v1(47.25,169.04) v1(47.73,242.96) v1(49.03,214) v1(50.04,201.68) v1(52.67,167.04) v1(53.24,242.71) v1(54.86,214) v1(56.36,203.21) v1(59.82,242.82) v1(59.82,214) v1(60.12,164.66) v1(63.88,202.95) v1(65.03,242.82) v1(65.95,163.08) v1(66.44,214) v1(69.27,241.82) v1(70.23,161.92) v1(71.76,53.09) v1(71.8,214) v1(73.54,241.82) v1(75.31,160.78) v1(76.71,202.95) v1(77.61,214) v1(79.03,241.81) v1(81.71,159.06) v1(82.55,214) v1(85.35,241.81) v1(85.47,202.95) v1(86.93,214) v1(88.61,158.63) v1(89.67,239.52) v1(91.25,214) v1(92.84,236.35) v1(94.62,161.54) v1(94.86,214) v1(95,203.07) v1(96.92,214) v1(97.29,164.21) v1(98.05,182.09) v1(98.05,178.51) v1(98.05,172.72) v1(98.05,168.53) v1(98.37,235.09) v1(98.81,185.29) v1(99.07,216.17) v1(99.95,231.47) v1(99.95,227.24) v1(100.08,223.94) v1(100.08,219.71) v1(101.59,203) v1(103.13,189.48) v1(105.82,201.93) v1(107.83,198.75) v1(107.95,194.44) v1(136.53,170.17) v1(136.53,166.86) v1(136.53,163.75) v1(137.23,158.82) v1(138.9,173.32) v1(139.83,158.12) v1(141.35,177.42) v1(142.17,180.74) v1(143.12,158.12) v1(144.28,184.02) v1(148.56,158.12) v1(149.75,184.02) v1(153.8,184.4) v1(156,158.12) v1(159.77,184.66) v1(164.72,159.13) v1(166.37,184.66) v1(173.25,159.27) v1(173.81,184.63) v1(179.81,159.13) v1(180.55,184.31) v1(185.3,184.15) v1(186.32,159.13) v1(190.12,183.77) v1(193.68,159.13) v1(193.93,183.01) v1(197.25,182.14) v1(199.27,161.29) v1(200.53,182.14) v1(202.57,164.59) v1(203.48,174.35) v1(203.48,170.01) v1(203.71,181.1) v1(203.97,178.06) v1(212.22,165.73) v1(212.35,174.42) v1(212.35,169.39) v1(212.79,161.24) v1(213.95,178.14) v1(216.84,160.79) v1(217.05,181.24) v1(220.31,160.79) v1(220.6,188.47) v1(224.82,195.11) v1(226.83,162.18) v1(228.22,89.53) v1(229.08,199.36) v1(233.18,162.05) v1(234.49,204.78) v1(238.35,208.64) v1(240.54,162.18) v1(241.94,212.23) v1(246.64,213.11) v1(249.89,163.73) v1(252.09,213.11) v1(256.35,211.9) v1(256.67,165.11) v1(259.3,209.72) v1(261.24,208.29) v1(261.37,166.88) v1(264.67,206.5) v1(265.69,169.29) v1(268.21,203.61) v1(269.12,171.2) v1(270.77,175.01) v1(271.53,178.56) v1(272.78,199.38) v1(273.58,181.86) v1(275.33,194.33) v1(275.38,185.51) v1(275.74,188.48)
BBALL: length 223.5
  Top Layer w0.254: 93.6,76.07 98,80.47 236.78,80.47 237.81,79.44 237.81,2.35
BTOE: length 308.2
  Top Layer w0.254: 238.81,2.35 238.81,79.38 238.67,79.52 238.67,79.85 234.06,84.45 21.09,84.45 13.21,76.58
HEEL: length 2.5
  Top Layer w0.254: 242.83,82.3 244.61,84.07
Heel: length 79.9
  Top Layer w0.254: 242.81,2.35 242.83,82.3
MID: length 134.4
  Top Layer w0.254: 201.55,118.36 204.47,118.36 241.81,81.02 241.81,2.35
OBALL: length 233
  Top Layer w0.254: 240.81,2.35 240.81,79.86 230.64,90.04 229.62,90.04 211.71,107.95 97.16,107.95 97.03,107.82
OTOE: length 296.1
  Top Layer w0.254: 29.21,99.31 40.26,99.31 51.69,87.88 231.64,87.88 239.81,79.71 239.81,2.35

## Copper pours and planes (outline as drawn; the poured copper is in the pictures)
GND on Top Layer: 1.72,211.21 31.69,211.21 31.69,182.38 1.72,182.38
GND on Top Layer: 19.69,242.96 99.95,242.96 99.95,213.73 19.69,213.73
GND on Top Layer: 136.53,184.79 203.97,184.79 203.97,158.12 136.53,158.12
GND on Top Layer: 35.69,203.21 107.83,203.21 107.83,158.63 35.69,158.63
GND on Top Layer: 212.35,213.11 275.98,213.11 275.98,160.79 212.35,160.79
GND on Top Layer: 2.67,238.63 26.42,238.63 26.42,214 2.67,214
GND on Bottom Layer: -13.97,268.61 283.09,268.61 283.09,5.46 -13.97,5.46
BBALL on Top Layer: 19.69,82.45 99.95,82.45 99.95,53.21 19.69,53.21
BTOE on Top Layer: 2.67,82.17 26.42,82.17 26.42,57.54 2.67,57.54
HEEL on Top Layer: 212.35,135.38 275.98,135.38 275.98,83.06 212.35,83.06
MID on Top Layer: 136.53,138.05 203.97,138.05 203.97,111.38 136.53,111.38
OBALL on Top Layer: 35.69,137.54 107.83,137.54 107.83,92.96 35.69,92.96
OTOE on Top Layer: 1.59,113.79 31.56,113.79 31.56,84.96 1.59,84.96

# Board PCB2
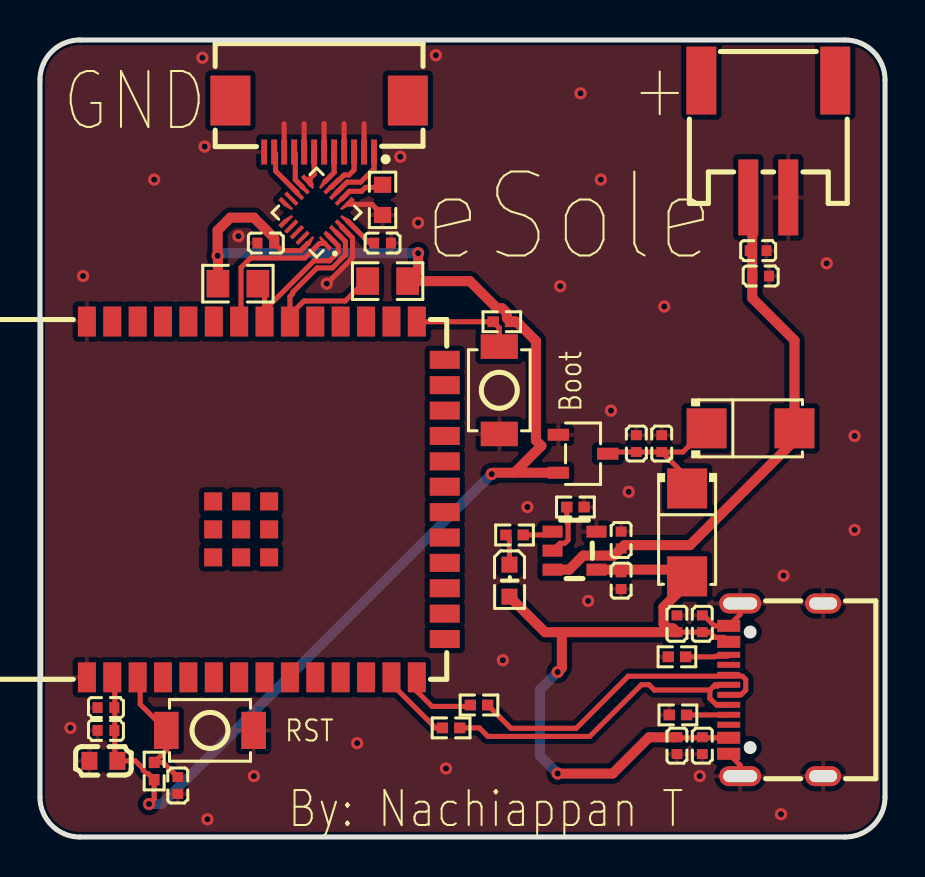
[diagram p4: board, top side]
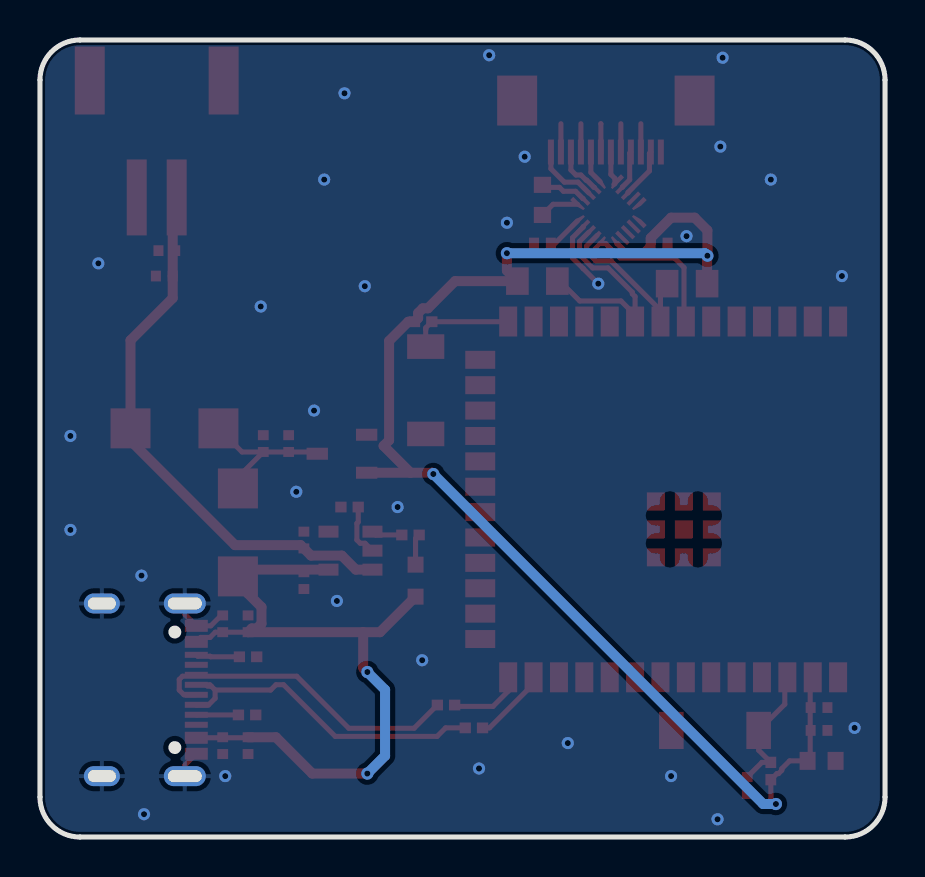
[diagram p5: board, bottom side, seen from below]

Outline 42.29 x 39.88 mm; copper layers: Top Layer, Bottom Layer. Coordinates in mm from the lower left corner of the outline.
Outline path: 0,37.88 0,2 arc(0.59,0.59) 2,0 40.29,0 arc(41.71,0.59) 42.29,2 42.29,37.88 arc(41.71,39.29) 40.29,39.88 2,39.88 arc(0.59,39.29) 0,37.88
Stack: Top Layer 0.035mm / Dielectric1 1.51mm FR4 er 4.5 / Bottom Layer 0.035mm

## Design rules (mm)
net $1N17: DP1
net DN: DP2
net DP: DP2
net $1N93: DP1
spacing copperThickness1oz (default): track to track 0.102, other pairs 0.152 to 0.3
spacing copperThickness2oz: track to track 0.203, other pairs 0.152 to 0.3
track width copperThickness1oz (default): min 0.127, default 0.254, max 2.54
track width copperThickness2oz: min 0.203, default 0.254, max 2.54
differential pair differentialPair (default): width min 0.127, default 0.254, max 2.54; gap min 0.152, default 0.152
net GND uses copperRegion

## Placement (name value [footprint] x y rotation side)
C1  100nF  [C0402]  33.15 10.67 270 top
C2  100nF  [C0402]  33.15 4.57 90 top
C3  1uF  [C0402]  31.88 10.67 270 top
C4  1uF  [C0402]  31.88 4.57 90 top
C5  100nF  [C0402]  31.12 19.69 270 top
C6  1uF  [C0402]  29.84 19.69 270 top
C7  100nF  [C0402]  35.94 29.34 180 top
C8  1uF  [C0402]  36.07 28.07 180 top
C9  4.7uF  [C0402]  29.08 12.83 90 top
C10  4.7uF  [C0402]  29.08 14.86 270 top
C11  10uF  [C0603]  3.18 3.81 0 top
C12  1uF  [C0402]  3.3 5.33 0 top
C13  100nF  [C0402]  3.3 6.48 0 top
C14  1uF  [C0402]  6.9 2.58 90 top
C15  100nF  [C0402]  11.3 29.72 0 top
C16  100nF  [C0402]  17.15 29.72 180 top
CN1  S2B-PH-SM4-TB(LF)(SN)  [CONN-SMD_P2.00_S2B-PH-SM4-TB-LF-SN]  36.45 34.92 180 top
D1  SS34  [SMA_L4.3-W2.6-LS5.2-RD]  32.39 15.24 270 top
D2  SS34  [SMA_L4.3-W2.6-LS5.2-RD]  35.56 20.45 0 top
FPC1  FPC-05F-12PH20  [FPC-SMD_12P-P0.50_FPC-05F-12PH20]  13.97 35.56 180 top
LED1  KT-0603W  [LED0603-R-RD_WHITE]  23.5 12.83 270 top
R1  5.1kΩ  [R0402]  31.93 6.11 0 top
R2  5.1kΩ  [R0402]  31.88 9.02 0 top
R3  0Ω  [R0402]  20.57 5.46 180 top
R4  0Ω  [R0402]  21.97 6.6 0 top
R5  2kΩ  [R0402]  26.8 16.51 0 top
R6  470Ω  [R0402]  23.75 15.11 0 top
R7  10kΩ  [R0402]  5.72 3.3 90 top
R8  10kΩ  [R0402]  23.11 25.78 0 top
R9  75kΩ  [R0603]  17.15 31.88 90 top
R10  4.7kΩ  [R0805]  17.4 27.81 180 top
R11  4.7kΩ  [R0805]  9.91 27.69 0 top
SW1  TS-1088-AR02016  [SW-SMD_L3.9-W3.0-P4.45]  22.99 22.35 90 top
SW2  TS-1088-AR02016  [SW-SMD_L3.9-W3.0-P4.45]  8.51 5.33 180 top
U1  2.4GHz  [WIFIM-SMD_ESP32-S3-WROOM-1-N8]  11.3 16.89 90 top
U2  MPR121QR2  [QFN-20_L3.0-W3.0-P0.40-BL]  13.84 31.24 45 top
U3  MCP73831T-2DCI/OT  [SOT-23-5_L2.9-W1.6-P0.95-LS2.8-BL]  26.75 14.33 270 top
U4  XC6206P332MR-G  [SOT-23-3_L2.9-W1.6-P1.90-LS2.8-BR]  27.18 19.18 180 top
USB1  TYPE-C16PIN  [USB-C-SMD_TYPE-C16PIN]  36.83 7.37 90 top

## Footprints (pads in the part's own frame, mm; a bottom-side part is the same pattern mirrored in y, then rotated)
C0402
  rect 0.5x0.54 smd: 1(-0.42,0) 2(0.42,0)
C0603
  rect 0.8x0.9 smd: 1(-0.7,0) 2(0.7,0)
CONN-SMD_P2.00_S2B-PH-SM4-TB-LF-SN
  rect 1x3.8 smd: 1(-1,2.925) 2(1,2.925)
  rect 1.5x3.4 smd: 3(3.35,-2.925) 4(-3.35,-2.925)
FPC-SMD_12P-P0.50_FPC-05F-12PH20
  rect 0.3x1.25 smd: 1(-2.75,1.288) 2(-2.25,1.288) 3(-1.75,1.288) 4(-1.25,1.288) 5(-0.75,1.288) 6(-0.25,1.288) 7(0.25,1.288) 8(0.75,1.288) 9(1.25,1.288) 10(1.75,1.288) 11(2.25,1.288) 12(2.75,1.288)
  rect 2x2.5 smd: 13(4.44,-1.288) 14(-4.44,-1.288)
LED0603-R-RD_WHITE
  rect 0.8x0.8 smd: 1(0.8,0) 2(-0.8,0)
QFN-20_L3.0-W3.0-P0.40-BL
  custom 0.224x0.825 smd: 1(-0.8,-1.387) 5(0.8,-1.387) 11(0.8,1.387) 15(-0.8,1.387)
  rect 0.2x0.825 smd: 2(-0.4,-1.387) 3(0,-1.387) 4(0.4,-1.387) 12(0.4,1.387) 13(0,1.387) 14(-0.4,1.387)
  custom 0.825x0.224 smd: 6(1.387,-0.8) 10(1.387,0.8) 16(-1.387,0.8) 20(-1.387,-0.8)
  rect 0.825x0.2 smd: 7(1.387,-0.4) 8(1.387,0) 9(1.387,0.4) 17(-1.387,0.4) 18(-1.387,0) 19(-1.387,-0.4)
R0402
  rect 0.566x0.54 smd: 1(-0.433,0) 2(0.433,0)
R0603
  rect 0.806x0.864 smd: 1(-0.753,0) 2(0.753,0)
R0805
  rect 1.133x1.377 smd: 1(-1,0) 2(1,0)
SMA_L4.3-W2.6-LS5.2-RD
  rect 2x2 smd: 1(-2.2,0) 2(2.2,0)
SOT-23-3_L2.9-W1.6-P1.90-LS2.8-BR
  rect 1.07x0.6 smd: 1(1.235,-0.95) 2(1.235,0.95) 3(-1.235,0)
SOT-23-5_L2.9-W1.6-P0.95-LS2.8-BL
  rect 0.6x1 smd: 1(-0.95,-1.1) 2(0,-1.1) 3(0.95,-1.1) 4(0.95,1.1) 5(-0.95,1.1)
SW-SMD_L3.9-W3.0-P4.45
  rect 1.23x1.86 smd: 1(-2.185,0) 2(2.185,0)
USB-C-SMD_TYPE-C16PIN
  oval 1x2.1 hole 0.6x1.7: 1(-4.32,1.788) 2(4.32,1.788)
  oval 1x1.8 hole 0.6x1.4: 3(-4.32,-2.362) 4(4.32,-2.362)
  rect 0.6x1.15 smd: A1B12(-3.2,2.362) A4B9(-2.4,2.362) B1A12(3.2,2.362) B4A9(2.4,2.362)
  rect 0.3x1.15 smd: A5(-1.25,2.362) A6(-0.25,2.362) A7(0.25,2.362) A8(1.25,2.362) B5(1.75,2.362) B6(0.75,2.362) B7(-0.75,2.362) B8(-1.75,2.362)
WIFIM-SMD_ESP32-S3-WROOM-1-N8
  rect 1.5x0.9 smd: 1(-8.9,8.954) 2(-8.9,7.684) 3(-8.9,6.415) 4(-8.9,5.144) 5(-8.9,3.874) 6(-8.9,2.604) 7(-8.9,1.335) 8(-8.9,0.065) 9(-8.9,-1.206) 10(-8.9,-2.475) 11(-8.9,-3.745) 12(-8.9,-5.016) 13(-8.9,-6.285) 14(-8.9,-7.556) 27(8.9,-7.556) 28(8.9,-6.285) 29(8.9,-5.016) 30(8.9,-3.745) 31(8.9,-2.475) 32(8.9,-1.206) 33(8.9,0.065) 34(8.9,1.335) 35(8.9,2.604) 36(8.9,3.874) 37(8.9,5.144) 38(8.9,6.415) 39(8.9,7.684) 40(8.9,8.954)
  rect 0.9x1.5 smd: 15(-6.985,-8.954) 16(-5.715,-8.954) 17(-4.445,-8.954) 18(-3.175,-8.954) 19(-1.905,-8.954) 20(-0.635,-8.954) 21(0.635,-8.954) 22(1.905,-8.954) 23(3.175,-8.954) 24(4.445,-8.954) 25(5.715,-8.954) 26(6.985,-8.954)
  rect 0.9x0.9 smd: 41(-2.9,2.635) 41(-2.9,1.235) 41(-2.9,-0.165) 41(-1.5,2.635) 41(-1.5,1.235) 41(-1.5,-0.165) 41(-0.1,2.635) 41(-0.1,1.235) 41(-0.1,-0.165)

## Nets
As in the schematic.

Pads without a net: CN1 3 4; FPC1 13 14; U1 4 5 6 7 8 9 10 11 12 15 16 17 18 19 20 21 22 23 24 25 26 28 29 30 31 35 36 37 38 39 41; U2 14 15 16 17 18 19; USB1 A8 B8

## Via types
v1: diameter 0.61, hole 0.305, Top Layer to Bottom Layer, 35 vias

## Routing (per net, layer and track width the routed paths; a pad name or vN(x,y) marks a point on that pad's centre or on a via; arc(x,y) is an arc through that point)
3V3: length 70.5
  Top Layer w0.254: C15.2 12.1,29.34 13.04,29.34 13.4,29.69 13.43,29.69 ; v1(5.46,1.65) 5.72,1.91 5.72,2.87 5.41,3.17 5.33,3.17 5.17,3.34 5.17,3.42 4.77,3.81 C11.2 3.75,3.94 3.75,7.99
  Top Layer w0.5: U4.2 23.75,18.23 ; 23.75,18.23 25.09,19.57 24.82,19.85 24.82,24.82 23.86,25.78 R8.2 23.37,25.96 23.37,26.22 23.13,26.45 22.88,26.45 21.52,27.81 R10.1 18.92,28.34 v1(18.92,29.21) ; 23.75,18.23 22.67,18.23 v1(22.61,18.16) ; 8.91,27.56 8.91,29.07 v1(8.89,29.08) 8.89,30.35 9.53,30.99 10.71,30.99 11.72,29.97 C15.2
  Bottom Layer w0.5: v1(18.92,29.21) 9.02,29.21 v1(8.89,29.08) ; v1(22.61,18.16) 6.1,1.65 v1(5.46,1.65)
3V7: length 27.9
  Top Layer w0.5: CN1.2 35.65,31.8 C8.2 35.65,26.96 37.76,24.85 D2.2 37.76,19.83 32.53,14.61 29.25,14.61 C10.2 28.72,14.08 27.19,14.08 26.48,13.38 U3.3
GND: length 16.9
  Top Layer w0.254: FPC1.2 16.22,35.69 ; U2.6 16.61,31.66 R9.1 ; C1.1 33.18,11.13 33.74,10.57 USB1.B1A12 35.04,11.14 USB1.2 ; FPC1.4 15.22,35.69 ; v1(14.35,27.69) 15.11,28.44 15.11,28.44 15.64,28.98 15.64,29.98 15.11,30.51 U2.4 ; USB1.1 35.04,3.59 USB1.A1B12 ; FPC1.6 14.22,35.68 14.22,35.69 ; FPC1.10 12.22,35.69 ; FPC1.8 13.22,35.69
  vias: v1(1.52,5.46) v1(2.16,28.07) v1(5.72,32.89) v1(8.13,38.99) v1(8.24,34.54) v1(8.38,0.89) v1(9.93,30.06) v1(10.71,3.05) v1(15.88,4.7) v1(18.03,34.04) v1(18.92,30.73) v1(19.81,39.12) v1(20.32,3.43) v1(23.16,8.85) v1(24.39,16.51) v1(26.03,27.56) v1(27.05,37.21) v1(27.43,11.81) v1(28.07,32.89) v1(28.58,21.34) v1(29.46,17.27) v1(31.24,26.54) v1(33.02,3.05) v1(37.08,1.14) v1(37.21,13.08) v1(39.37,28.7) v1(40.77,20.07) v1(40.77,15.37)
VBUS: length 37.5
  Top Layer w0.254: USB1.B4A9 34.25,9.99 33.78,9.99 33.52,10.25 C1.2 C3.2 ; USB1.A4B9 31.9,4.97 C4.2
  Top Layer w0.5: 26.12,10.25 25.27,10.25 LED1.1 ; 26.12,10.25 26.12,8.46 v1(25.91,8.25) ; 26.12,10.25 C3.2 31.69,10.44 31.44,10.44 31.21,10.67 31.21,11.5 31.88,12.18 31.88,12.53 D1.2 32.05,13.38 U3.4 ; C4.2 30.48,4.99 28.66,3.17 v1(25.91,3.17)
  Bottom Layer w0.5: v1(25.91,3.17) 25.02,4.06 25.02,7.37 v1(25.91,8.25)
BBALL: length 1.5
  Top Layer w0.254: 11.79,33.32 12.86,32.25 12.86,32.22
BBall: length 1
  Top Layer w0.254: FPC1.11 11.79,34.2 11.79,33.32
BToe: length 1.9
  Top Layer w0.254: FPC1.9 12.78,34.21 12.78,32.89 13.15,32.52 13.15,32.51
DN: length 16.1
  Top Layer w0.254: R3.1 21.99,5.46 22.42,5.04 27.51,5.04 30.1,7.62 30.48,7.62 30.75,7.35 33.53,7.35 ; 33.72,7.55 33.53,7.35 ; 33.72,7.55 33.91,7.55 ; 33.72,7.55 33.79,7.62 33.91,7.62 ; 33.53,7.35 33.53,6.94 33.86,6.6 34.46,6.6 USB1.B7
DP: length 16
  Top Layer w0.254: R4.2 23.57,5.44 26.84,5.44 29.44,8.05 35.16,8.05 35.32,7.88 35.32,7.35 35.09,7.12 USB1.A6
HEEL: length 2.5
  Top Layer w0.254: 15.37,32.77 16.05,32.77 16.72,33.44 16.72,34.27
Heel: length 0.8
  Top Layer w0.254: U2.8 15.37,32.77
IRQ: length 7.4
  Top Layer w0.254: 14.26,29.69 13.98,29.69 13.26,28.97 10.54,28.97 10.06,28.49 10.06,25.88 9.97,25.79
MID: length 2.4
  Top Layer w0.254: 15.72,34.27 15.72,33.37 15.47,33.12 15.22,33.12 14.96,32.86 14.93,32.86 14.57,32.51 14.54,32.51
OBall: length 1.7
  Top Layer w0.254: FPC1.5 14.72,33.25 14.26,32.79
OTOE: length 0.3
  Top Layer w0.254: 13.52,32.95 13.52,32.7 13.57,32.64
OToe: length 1.4
  Top Layer w0.254: FPC1.7 13.72,33.15 13.52,32.95
SCL: length 7.9
  Top Layer w0.254: 10.91,27.56 11.24,27.23 11.24,26.35 ; 11.24,26.35 13.71,28.83 14.48,28.83 14.93,29.27 14.93,29.58 14.4,30.1 ; 11.24,26.35 11.24,25.79
SDA: length 10.7
  Top Layer w0.254: 14.82,30.26 15.28,29.8 15.28,29.13 14.63,28.47 13.86,28.47 12.65,27.26 12.65,27.18 12.51,27.04 12.51,26.12 ; 12.51,26.12 12.51,25.79 ; 12.51,26.12 13.21,26.82 15.28,26.82 16.27,27.81
$1N6: length 2.1
  Top Layer w0.254: USB1.A5 34.46,6.11 32.36,6.11
$1N8: length 2.2
  Top Layer w0.254: R2.2 33.75,9.02 33.78,9.05 34.4,9.05 USB1.B5
$1N10: length 7.8
  Top Layer w0.254: C5.2 32.13,18.25 32.13,17.69 D1.1 ; C5.2 C6.2 28.5,19.27 U4.3 ; C5.2 32.18,19.27 D2.1
$1N17: length 3.8
  Top Layer w0.254: R3.2 19.79,5.46 17.59,7.67 U1.13
$1N49: length 2.7
  Top Layer w0.254: R5.1 26.36,15.76 26.43,15.69 26.43,14.86 26.27,14.7 26.02,14.7 U3.2
$1N54: length 1.5
  Top Layer w0.254: R6.2 25.49,15.11 U3.1
$1N55: length 1.6
  Top Layer w0.254: LED1.2 23.5,14.93 R6.1
$1N65: length 6.5
  Top Layer w0.254: 5.02,7.99 5.02,6.64 SW2.2 6.32,4.34 R7.2 6.16,3.73 C14.2
$1N68: length 5.2
  Top Layer w0.254: 18.86,25.79 18.87,25.78 R8.1 22.99,25.48 22.99,25.4 22.99,25.39 SW1.2
$1N84: length 1.8
  Top Layer w0.254: U2.5 16.5,29.72 C16.2
$1N85: length 2.3
  Top Layer w0.254: 17.15,32.5 16.29,32.5 16.1,32.31 15.49,32.31 15.12,31.94 U2.7
$1N93: length 3.7
  Top Layer w0.254: U1.14 18.86,7.3 19.62,6.53 21.47,6.53 R4.1

## Copper pours and planes (outline as drawn; the poured copper is in the pictures)
GND on Top Layer: -1.65,41.66 44.32,41.66 44.32,-2.41 -1.65,-2.41
GND on Bottom Layer: -2.41,42.29 44.96,42.29 44.96,-2.16 -2.41,-2.16

## Text on the board
Top Silkscreen Layer: RST | Boot | By: Nachiappan T | GND | + | eSole
